# Altium schematic sheet input_output.SchDoc
size A4; SheetNumber: 2; SheetTotal: 6
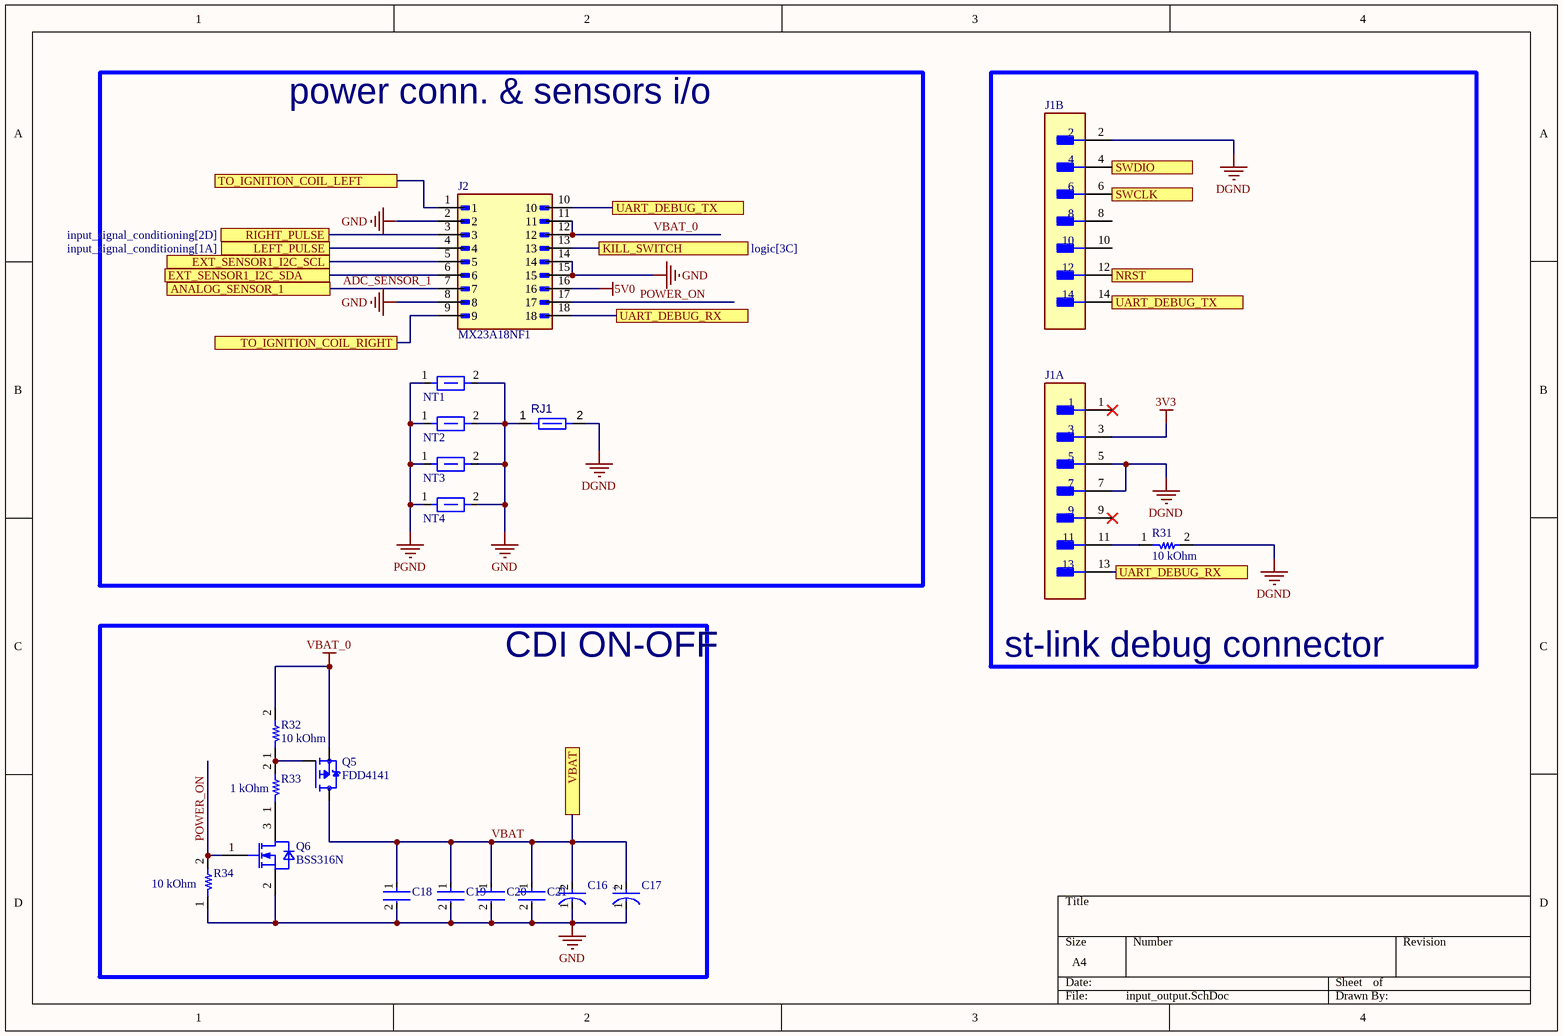
[diagram p0: input_output.SchDoc]

## Parts
C16  EEHZT1E221P  [FP-EEH-F-MFG]  (value not drawn)
C17  EEHZT1E221P  [FP-EEH-F-MFG]  (value not drawn)
C18  C1206X104J3GACTU  [FP-C1206X104J3GACTU-MFG]  (value not drawn)
C19  C1206X104J3GACTU  [FP-C1206X104J3GACTU-MFG]  (value not drawn)
C20  C1206X104J3GACTU  [FP-C1206X104J3GACTU-MFG]  (value not drawn)
C21  C1206X104J3GACTU  [FP-C1206X104J3GACTU-MFG]  (value not drawn)
J1  FTSH-107-01-F-DV-K  [FP-FTSH-107-01-F-DV-K-MFG]  (value not drawn)  (parts A,B of 2)
J2  MX23A18NF1  [JAE_MX23A18NF1]
NT1  GROUND_NET_TIE  [NET_TIE_GND]  (value not drawn)  (net tie, no BOM)
NT2  GROUND_NET_TIE  [NET_TIE_GND]  (value not drawn)  (net tie, no BOM)
NT3  GROUND_NET_TIE  [NET_TIE_GND]  (value not drawn)  (net tie, no BOM)
NT4  GROUND_NET_TIE  [NET_TIE_GND]  (value not drawn)  (net tie, no BOM)
Q5  FDD4141  [TO252]
Q6  BSS316N  [SOT95P260X110-3N]
R31  value 10 kOhm  [0603_FP]  (hidden comment: Resistor_0603)
R32  value 10 kOhm  [0603_FP]  (hidden comment: Resistor_0603)
R33  value 1 kOhm  [0603_FP]  (hidden comment: Resistor_0603)
R34  value 10 kOhm  [0603_FP]  (hidden comment: Resistor_0603)
RJ1  Net Tie 12x8mil  [SHORT06-FP]  (value not drawn)  (net tie, no BOM)

## Blocks framed on the sheet
power conn. & sensors i/o: J2 NT1-NT4 RJ1
st-link debug connector: J1 R31
CDI ON-OFF: C16-C21 Q5 Q6 R32-R34

## Ports
ANALOG_SENSOR_1 (see logic[1A]), EXT_SENSOR1_I2C_SCL (see logic[3A]), EXT_SENSOR1_I2C_SDA (see logic[3A]), KILL_SWITCH (see logic[3C]), LEFT_PULSE (see input_signal_conditioning[1A]), NRST (see logic[3B]), RIGHT_PULSE (see input_signal_conditioning[2D]), SWCLK (see logic[1B]), SWDIO (see logic[1B]), TO_IGNITION_COIL_LEFT (see cd_switching[6B]), TO_IGNITION_COIL_RIGHT (see cd_switching[6B]), UART_DEBUG_RX (see input_output[2B], logic[1B]), UART_DEBUG_RX (see input_output[3C], logic[1B]), UART_DEBUG_TX (see input_output[2A], logic[1B]), UART_DEBUG_TX (see input_output[3B], logic[1B]), VBAT (see cd_switching[3A], cd_switching[3B], HV_power[1A], HV_power[1C], LV_power[1B])

## Nets
3V3: J1.3
5V0: J2.16
DGND: J1.2 J1.5 J1.7 R31.2 RJ1.2
GND: C16.1(C) C17.1(C) C18.2 C19.2 C20.2 C21.2 J2.2 J2.8 J2.14 J2.15 NT1.2 NT2.2 NT3.2 NT4.2 Q6.2(SOURCE) R34.1 RJ1.1
PGND: NT1.1 NT2.1 NT3.1 NT4.1
VBAT_0: J2.11 J2.12 Q5.2(S) R32.2
ADC_SENSOR_1: J2.7 ; port ANALOG_SENSOR_1
EXT_SENSOR1_I2C_SCL: J2.5 ; port EXT_SENSOR1_I2C_SCL
EXT_SENSOR1_I2C_SDA: J2.6 ; port EXT_SENSOR1_I2C_SDA
KILL_SWITCH: J2.13 ; port KILL_SWITCH
LEFT_PULSE: J2.4 ; port LEFT_PULSE
NRST: J1.12 ; port NRST
POWER_ON: J2.17 Q6.1(GATE) R34.2
RIGHT_PULSE: J2.3 ; port RIGHT_PULSE
SWCLK: J1.6 ; port SWCLK
SWDIO: J1.4 ; port SWDIO
TO_IGNITION_COIL_LEFT: J2.1 ; port TO_IGNITION_COIL_LEFT
TO_IGNITION_COIL_RIGHT: J2.9 ; port TO_IGNITION_COIL_RIGHT
UART_DEBUG_RX: J1.13 J2.18 ; port UART_DEBUG_RX
UART_DEBUG_TX: J1.14 J2.10 ; port UART_DEBUG_TX
VBAT: C16.2(A) C17.2(A) C18.1 C19.1 C20.1 C21.1 Q5.3(D) ; port VBAT
NetJ1_11: J1.11 R31.1
NetQ5_1: Q5.1(G) R32.1 R33.2
NetQ6_3: Q6.3(DRAIN) R33.1

Not connected (* = marked no-connect by the designer): J1 1* 8 9* 10

## Notes on the sheet
- (in symbol CMP-05428-000892-1) +

## Library data of the parts
C16 C17 = CMP-05428-000892-1: Conductive Polymer Hybrid Aluminum Electrolytic Capacitors 220uF ±20% 25V RADIAL SMT 8x10.2mm
C18-C21 = CMP-03020-034648-1: CAP CER 0.1UF 25V C0G/NP0 1206; RoHS Compliant: Yes
J1 = CMP-02766-001448-1: CONN HEADER SMD 14POS 1.27MM; Gender: Male; Connector Type: Male Pin; Number of Contacts: 14; Row Spacing: 0.05inch; Min Operating Temperature: -55°C; Package Quantity: 1; Lead Free: Lead Free; RoHS Compliant: Yes; Contact Material: Bronze; Contact Plating: Gold; Number of Rows: 2; Housing Material: Polymer; Contact Type: Male Pin; Series: FTSH; Max Operating Temperature: 125°C; Orientation: Straight; Number of Positions: 14; Pitch: 1.27mm; Housing Color: Black; Color: Black; Radiation Hardening: No; Length: 8.89mm; Termination: Solder; Packaging: Rail/Tube; Depth: 5.84mm; Mount: Surface Mount; Contact Mating Length: 0.12inch
J2 = MX23A18NF1: MF: JAE Electronics; SnapEDA_Link: https://www.snapeda.com/parts/MX23A18NF1/JAE+Electronics/view-part/?ref=snap; Package: None; Value: *; MP: MX23A18NF1; Check_prices: https://www.snapeda.com/parts/MX23A18NF1/JAE+Electronics/view-part/?ref=eda
Q5 = FDD4141: P-Channel 40V 10.8A (Ta), 50A (Tc) 2.4W (Ta), 69W (Tc) Surface Mount D-PAK (TO-252AA); MF: onsemi; SnapEDA_Link: https://www.snapeda.com/parts/FDD4141/Onsemi/view-part/?ref=snap; Package: TO-252-3 ON Semiconductor; Value: *; MP: FDD4141; Check_prices: https://www.snapeda.com/parts/FDD4141/Onsemi/view-part/?ref=eda
Q6 = BSS316N: Insulated-Gate Field-Effect Transistor (IGFET), N-Channel, Enhancement, Body Diode, Pin 1 Gate, 2 Source, 3 Drain, 3 Pins; Manufacturer: Infineon Technologies; ManufacturerPartNumber: BSS316N; PackageReference: PG-SOT23-3-5
R31-R34 = Resistor_0603: Format: 0402; Package: 0402
RJ1 = CMP-009-00121-2: Max Operating Temperature: 155°C; Pins: 2; Min Operating Temperature: -55°C